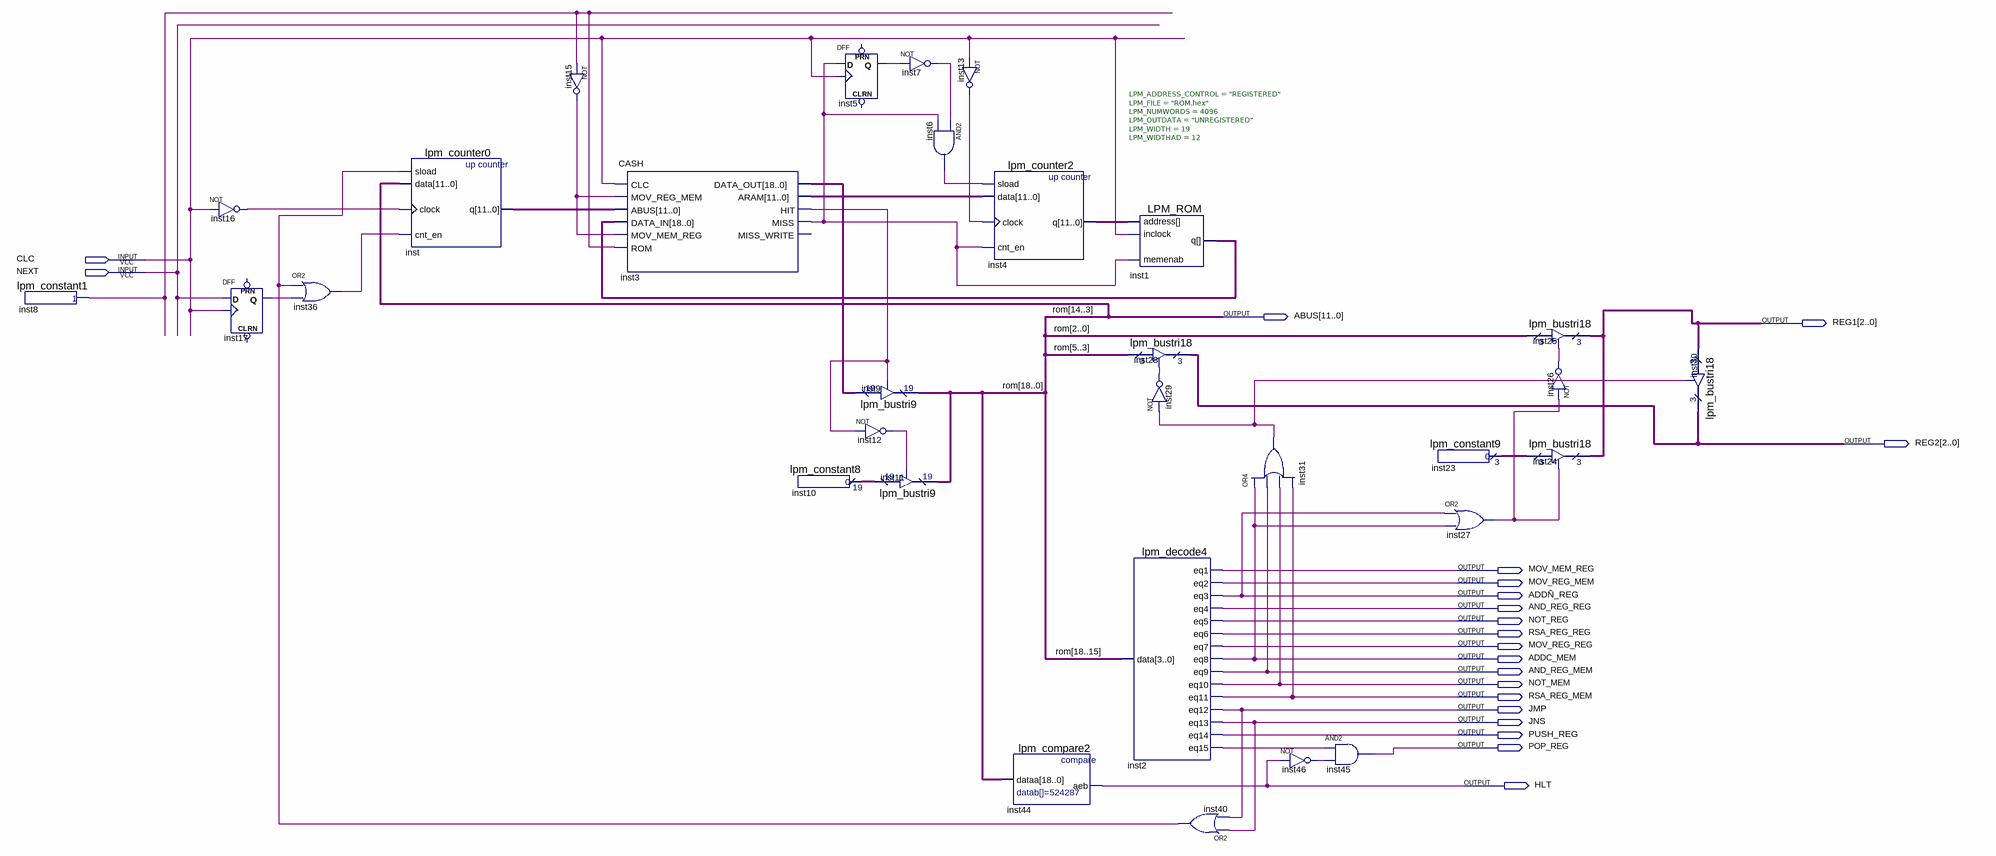
[diagram p0: schematic sheet]
// Quartus schematic CU.bdf as structural Verilog: 31 symbols, 21 pins
module CU (
  input  CLC,
  input  NEXT,
  output [11:0] ABUS,
  output [2:0] REG1,
  output [2:0] REG2,
  output MOV_MEM_REG,
  output MOV_REG_MEM,
  output \ADDÑ_REG ,
  output AND_REG_REG,
  output NOT_REG,
  output RSA_REG_REG,
  output MOV_REG_REG,
  output ADDC_MEM,
  output AND_REG_MEM,
  output NOT_MEM,
  output RSA_REG_MEM,
  output JMP,
  output JNS,
  output PUSH_REG,
  output POP_REG,
  output HLT
);

  wire inst2_eq15, inst3_hit, inst3_miss, inst5_q, inst6_out, inst7_out, inst8_result, inst12_out,
       inst13_out, inst15_out, inst16_out, inst17_q, inst26_out, inst27_out, inst29_out, inst31_out,
       inst36_out, inst40_out, inst46_out;
  wire [2:0] inst23_result;
  wire [11:0] inst3_aram, inst4_q, inst_q;
  wire [18:0] inst1_q, inst3_data_out, inst10_result, rom;

  lpm_constant1 inst8 (.result(inst8_result));
  not inst16 (inst16_out, CLC);
  DFF inst17 (.CLK(CLC), .D(NEXT), .Q(inst17_q));  // open: CLRN, PRN
  or inst36 (inst36_out, inst40_out, inst17_q);
  lpm_counter0 inst (.sload(inst40_out), .data(ABUS), .clock(inst16_out), .cnt_en(inst36_out), .q(inst_q));
  not inst15 (inst15_out, inst8_result);
  CASH inst3 (
    .CLC(CLC), .MOV_REG_MEM(inst15_out), .ABUS(inst_q), .DATA_IN(inst1_q), .MOV_MEM_REG(inst15_out),
    .ROM(inst8_result), .DATA_OUT(inst3_data_out), .ARAM(inst3_aram), .HIT(inst3_hit), .MISS(inst3_miss));  // open: MISS_WRITE
  lpm_constant8 inst10 (.result(inst10_result));
  DFF inst5 (.CLK(CLC), .D(inst3_miss), .Q(inst5_q));  // open: CLRN, PRN
  lpm_bustri9 inst9 (.enabledt(inst3_hit), .data(inst3_data_out), .tridata({rom[18:15], ABUS, rom[2:0]}));
  not inst12 (inst12_out, inst3_hit);
  not inst7 (inst7_out, inst5_q);
  lpm_bustri9 inst11 (.enabledt(inst12_out), .data(inst10_result), .tridata({rom[18:15], ABUS, rom[2:0]}));
  not inst13 (inst13_out, CLC);
  and inst6 (inst6_out, inst7_out, inst3_miss);
  lpm_counter2 inst4 (.sload(inst6_out), .data(inst3_aram), .clock(inst13_out), .cnt_en(inst3_miss), .q(inst4_q));
  lpm_compare2 inst44 (.dataa({rom[18:15], ABUS, rom[2:0]}), .aeb(HLT));
  LPM_ROM #(.LPM_ADDRESS_CONTROL("REGISTERED"), .LPM_FILE("ROM.hex"), .LPM_NUMWORDS(4096), .LPM_OUTDATA("UNREGISTERED"), .LPM_WIDTH(19), .LPM_WIDTHAD(12)) inst1 (
    .address(inst4_q), .inclock(CLC), .memenab(inst3_miss), .q(inst1_q));
  lpm_bustri18 inst28 (.enabledt(inst29_out), .data(ABUS[2:0]), .tridata(REG2));
  not inst29 (inst29_out, inst31_out);
  lpm_decode4 inst2 (
    .data(rom[18:15]), .eq1(MOV_MEM_REG), .eq2(MOV_REG_MEM), .eq3(\ADDÑ_REG ), .eq4(AND_REG_REG),
    .eq5(NOT_REG), .eq6(RSA_REG_REG), .eq7(MOV_REG_REG), .eq8(ADDC_MEM), .eq9(AND_REG_MEM), .eq10(NOT_MEM),
    .eq11(RSA_REG_MEM), .eq12(JMP), .eq13(JNS), .eq14(PUSH_REG), .eq15(inst2_eq15));
  or inst40 (inst40_out, JNS, JMP);
  or inst31 (inst31_out, ADDC_MEM, AND_REG_MEM, NOT_MEM, RSA_REG_MEM);
  not inst46 (inst46_out, HLT);
  and inst45 (POP_REG, inst2_eq15, inst46_out);
  lpm_constant9 inst23 (.result(inst23_result));
  or inst27 (inst27_out, \ADDÑ_REG , ADDC_MEM);
  lpm_bustri18 inst25 (.enabledt(inst26_out), .data(rom[2:0]), .tridata(REG1));
  not inst26 (inst26_out, inst27_out);
  lpm_bustri18 inst24 (.enabledt(inst27_out), .data(inst23_result), .tridata(REG1));
  lpm_bustri18 inst30 (.enabledt(inst31_out), .data(REG1), .tridata(REG2));

  // Other names for the same wires on the sheet: rom[14:3] = ABUS
endmodule
